# Altium project Startup Delay Circuit.PrjPcb
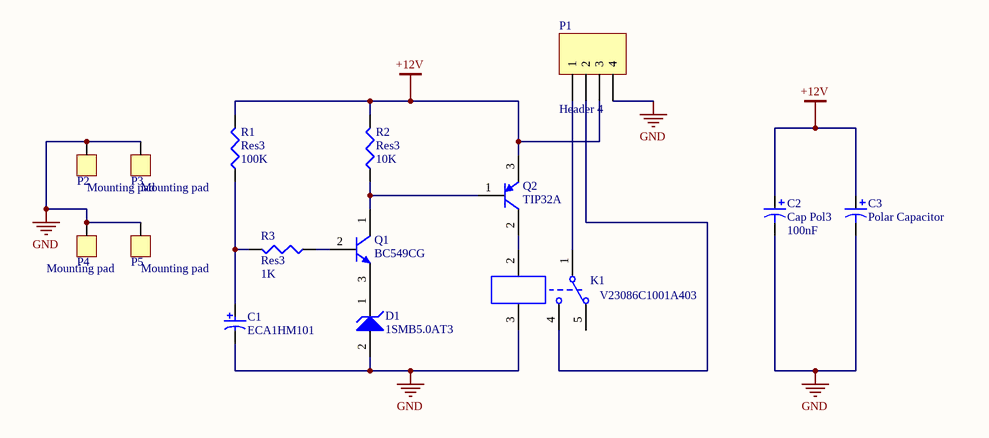
[diagram p0: Startup Delay.SchDoc]
1 sheet, 15 parts. Net scope: global (net labels, ports and power ports of the same name join across sheets).
Board file: Startup Delay.PcbDoc

## Sheet Startup Delay.SchDoc
size A4

### Parts
C1  ECA1HM101  [CAPPR65-350-1150X800X1250]
C2  Cap Pol3  value 100nF  [C0805]
C3  Polar Capacitor  [Case D]
D1  1SMB5.0AT3  [ONSC-SMB-2-403A-03_H_V]
K1  V23086C1001A403  [RELAY_SPDT_5]
P1  Header 4  [HDR1X4]
P2  Mounting pad  [Mounting pad]
P3  Mounting pad  [Mounting pad]
P4  Mounting pad  [Mounting pad]
P5  Mounting pad  [Mounting pad]
Q1  BC549CG  [ONSC-TO-92-3-29-04_AD]
Q2  TIP32A  [ONSC-TO-220-3-221A-09]
R1  Res3  value 100K  [J1-0603]
R2  Res3  value 10K  [J1-0603]
R3  Res3  value 1K  [J1-0603]

### Nets
+12V: C2.1 C3.1 P1.3 Q2.3(E) R1.2 R2.2
GND: C1.2 C2.2 C3.2 D1.2(A) K1.3 P1.4 P2.1 P3.1 P4.1 P5.1
NetC1_1: C1.1 R1.1 R3.2
NetD1_1: D1.1(K) Q1.3(E)
NetK1_1: K1.1 P1.1
NetK1_2: K1.2 Q2.2(C)
NetK1_4: K1.4 P1.2
NetQ1_1: Q1.1(C) Q2.1(B) R2.1
NetQ1_2: Q1.2(B) R3.1

Not connected (* = marked no-connect by the designer): K1 5

### Library data of the parts
C1 = CMP-2100-03623-1: Aluminum Electrolytic Capacitor, 100 uF, +/- 20%, 50 V, -40 to 85 degC, 2-Pin THD, RoHS, Bulk; Manufacturer: Panasonic; Lead Diameter: 0.6mm; Dielectric Material: Aluminium; Voltage Rating (DC): 50V; Ripple Current (AC): 250mA; Polarity: Polar; Leakage Current: 3uA; Capacitance: 100uF; Life (Hours): 2000Hour; Lead/Base Style: Straight; Dissipation Factor: 0.12%; Radiation Hardening: No; Height: 11.5mm; Package Quantity: 200; Package Reference: CAPPR65-350-1150X800X1250; Min Operating Temperature: -40degC; Mount: ThroughHole; Package Description: 2-Pin Radial Lead, Dia 8 mm, Height 12.5 mm; Case/Package: Radial; Diameter: 8mm; Voltage Rating: 50V; Length: 11.5mm; REACH SVHC: NoSVHC; Height - Seated (Max): 0.492inch; Datasheet URL: https://industrial.panasonic.com/cdbs/www-data/pdf/RDF0000/ABA0000C1218.pdf; RoHSCompliant: true; Ripple Current: 250mA; Lead Free: LeadFree; Voltage: 50V; Manufacturer URL: http://www.panasonic.com/; Number of Pins: 2; Datasheet Version: Rev. 05, 10/2016; Packaging: Bulk; Termination: Radial; Max Operating Temperature: 85degC; Tolerance: 20%; Lead Pitch: 3.5mm
C2 = Cap Pol3: Polarized Capacitor (Surface Mount); Published: 8-Jun-2000; LatestRevisionDate: 29-May-2009; LatestRevisionNote: IPC-7351 Footprint Added.; PackageReference: C0805; Publisher: Altium Limited; PackageDescription: Chip Capacitor
D1 = CMP-1061-00353-1: 600 W Peak Power Zener Transient Voltage Suppressor, Unidirectional, 2-Pin SMB, Tape and Reel; Manufacturer: On Semiconductor; PPK Max (W): 600; IR Max (uA): 800; V(BR) Typ (V): 6.7; ComponentLink1URL: http://www.onsemi.com/; Direction: Unidirectional; PartNumber: 1SMB5.0AT3; DatasheetVersion: Rev. 13; ComponentLink3URL: http://www.onsemi.com/pub_link/Collateral/1SMB5913BT3-D.PDF; ComponentLink2URL: http://www.onsemi.com/pub_link/Collateral/1SMB5.0AT3-D.PDF; ComponentLink3Description: Package Specification; Packing: Tape and Reel; ComponentLink2Description: Datasheet; PackageVersion: Rev. H, 05/2011; ComponentLink1Description: Manufacturer URL; PackageDescription: 2-Pin Small Molded Package, J-Bend Lead, Body 4.33 x 3.625 mm; Mounting Technology: Surface Mount; PackageReference: SMB-2-403A-03_H
K1 = CMP-1684-00018-1: TE Connectivity SPDT PCB Mount Automotive Relay, 12V DC Coil, -40 to 105 degC, 5-Pin THD, RoHS; Coil Resistance: 254ohm; External Depth: 12.9 / mm; External Width: 12 / mm; Relay Mounting: ThroughHole; SVHC: ToBeAdvised; Contact Current: 30A; Contact Current Max: 30 / A; Relay Terminals: Solder; Product Range: MicroRelayKSeries; External Height: 9.9 / mm; Coil Voltage: 12VDC; Datasheet URL: http://www.te.com.cn/commerce/DocumentDelivery/DDEController?Action=showdoc&DocId=Data+Sheet%7FV23086-X0000-A001%7F0717%7Fpdf%7FEnglish%7FENG_DS_V23086-X0000-A001_0717.pdf%7F1393280-6; Package Description: 5-Leads Through Hole Device, Body 12 x 12.9 mm; Contact Material: SilverTinOxide; Contact Configuration: SPDT; Manufacturer: TE Connectivity; Manufacturer URL: http://www.te.com; Package Reference: THD; Datasheet Version: Rev. 0717; Contact Voltage DC Nom: 12V; Mounting Technology: ThroughHole; Coil Voltage VDC Nom: 12 / V
P1 = Header 4: Header, 4-Pin; LatestRevisionDate: 17-Jul-2002; LatestRevisionNote: Re-released for DXP Platform.; Publisher: Altium Limited
Q1 = CMP-1048-01363-1: Low Noise Transistor, NPN Silicon, 3-Pin TO-92, Pb-Free, Bulk Box; Manufacturer: On Semiconductor; IC Continuous (A): 0.1; RoHS: TRUE; Mounting Technology: Through Hole; ComponentLink3URL: http://www.onsemi.com/pub_link/Collateral/BC549B-D.PDF; PackageDescription: 3-Pin Transistor Outline, Body 4.825 x 3.685 mm, Pitch 1.27 mm; DatasheetVersion: Rev. AD; ComponentLink3Description: Package Specification; ComponentLink1URL: http://www.onsemi.com/; PackageVersion: Rev. AD; PartNumber: BC549CG; Polarity: NPN; ComponentLink2Description: Datasheet; ComponentLink1Description: Manufacturer URL; Packing: Bulk Box; ComponentLink2URL: http://www.onsemi.com/pub_link/Collateral/BC549B-D.PDF; PackageReference: TO-92-3-29-04_AD
Q2 = CMP-1048-01079-1: Complementary Silicon Plastic Power Transistor, 3-Pin TO-220, Tube; Manufacturer: On Semiconductor; Polarity: PNP; IC Continuous (A): 3; ComponentLink3Description: Package Specification; ComponentLink2URL: http://www.onsemi.com/pub_link/Collateral/TIP31A-D.PDF; PackageDescription: 3-Pin Flange Mount, Vertical Straight Lead, Body 9.97 x 4.445 mm, Pitch 2.54 mm; PackageVersion: Rev. AG, 09/2011; Mounting Technology: Through Hole; RoHS: FALSE; ComponentLink1URL: http://www.onsemi.com/; ComponentLink2Description: Datasheet; PackageReference: TO-220-3-221A-09; fT Min (MHz): 3; ComponentLink1Description: Manufacturer URL; PartNumber: TIP32A; DatasheetVersion: Rev. 14; Packing: Tube; ComponentLink3URL: http://www.onsemi.com/pub_link/Collateral/221A-09.PDF
R1-R3 = Res3: Resistor; Published: 8-Jun-2000; LatestRevisionDate: 29-May-2009; LatestRevisionNote: IPC-7351 Footprint Added.; PackageReference: J1-0603; Publisher: Altium Limited; PackageDescription: Chip Resistor